# Altium schematic sheet Amp1.SchDoc
size A
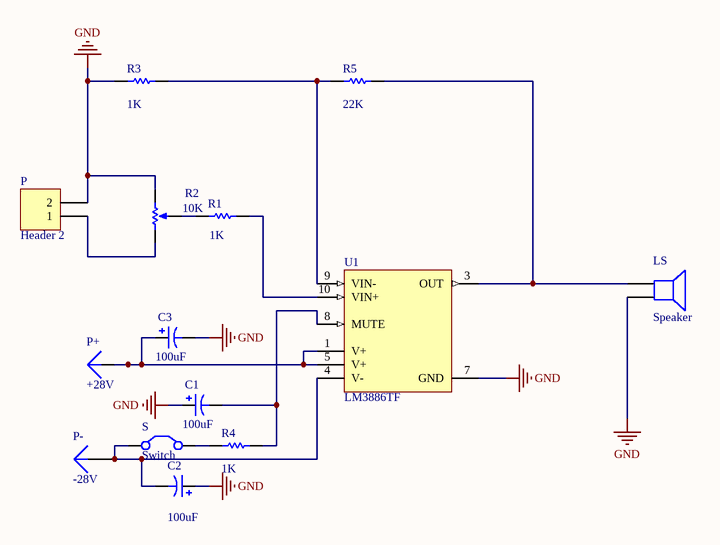
[diagram p0: Amp1.SchDoc]

## Parts
C1  value 100uF  [RB7.6-15]
C2  value 100uF  [RB7.6-15]
C3  value 100uF  [RB7.6-15]
LS  Speaker  [PIN2]
P  Header 2  [HDR1X2]
P+  +28V  [PIN1]
P-  -28V  [PIN1]
R1  value 1K  [AXIAL-0.3]
R2  value 10K  [VR5]
R3  value 1K  [AXIAL-0.3]
R4  value 1K  [AXIAL-0.3]
R5  value 22K  [AXIAL-0.3]
S  Switch  [RAD-0.2]
U1  LM3886TF  [TF11B]

## Nets
GND: C1.1 C2.1 C3.2 LS.2 P.2 R2.2(BOT) R3.1 U1.7(GND)
NetC1_2: C1.2 R4.2 U1.8(MUTE)
NetC2_2: C2.2 P-.1 S.1(C1) U1.4(V-)
NetC3_1: C3.1 P+.1 U1.1(V+) U1.5(V+)
NetLS_1: LS.1 R5.2 U1.3(OUT)
NetP_1: P.1 R2.1(TOP)
NetR1_1: R1.1 R2.3(TAP)
NetR1_2: R1.2 U1.10(VIN+)
NetR3_2: R3.2 R5.1 U1.9(VIN-)
NetR4_1: R4.1 S.2(C2)

## Library data of the parts
C1-C3 = Cap Pol1: Polarized Capacitor (Radial); Published: 8-Jun-2000; LatestRevisionDate: 17-Jul-2002; LatestRevisionNote: Re-released for DXP Platform.; PackageReference: RB7.6-15; Publisher: Altium Limited; PackageDescription: Polarized Capacitor (Radial); 2 Leads
LS = Speaker: Loudspeaker; Published: 24-Mar-1999; LatestRevisionDate: 17-Jul-2002; LatestRevisionNote: Re-released for DXP Platform.; PackageReference: PIN2; Publisher: Altium Limited
P = Header 2: Header, 2-Pin; LatestRevisionDate: 17-Jul-2002; LatestRevisionNote: Re-released for DXP Platform.; Publisher: Altium Limited
P+ P- = Plug: LatestRevisionDate: 17-Jul-2002; LatestRevisionNote: Re-released for DXP Platform.; Publisher: Altium Limited
R1 R3-R5 = Res1: Resistor; Published: 8-Jun-2000; LatestRevisionDate: 17-Jul-2002; LatestRevisionNote: Re-released for DXP Platform.; PackageReference: AXIAL-0.3; Publisher: Altium Limited; PackageDescription: Axial Device, Thru-Hole; 2 Leads; 0.3 in Pin Spacing
R2 = RPot: Potentiometer; Sim Note: Enter the Resistance value and the set point into parameter fields.; Set Position: 0.5; Published: 8-Jun-2000; LatestRevisionDate: 17-Jul-2002; LatestRevisionNote: Re-released for DXP Platform.; PackageReference: VR5; Publisher: Altium Limited; PackageDescription: Variable Resistor, Thru-Hole; 3 Leads
S = Jumper: Jumper Wire; Published: 24-Mar-1999; LatestRevisionDate: 17-Jul-2002; LatestRevisionNote: Re-released for DXP Platform.; PackageReference: RAD-0.2; Publisher: Altium Limited; PackageDescription: Radial Cap, Thru-Hole; 2 Leads; 0.2 in Pin Spacing
U1 = LM3886TF: High-Performance 68W Audio Power Amplifier with Mute, 11-pin Isolated TO220; Manufacturer: National Semiconductor; PackageTopMarking: NSUZXYTTE#*LM3886TF; PowerWise: N; CompType: Audio IC; Published: 4-Dec-2008; DatasheetVersion: Oct-2003; PackageVersion: revD, Apr-2003; PackageReference: TF11B; Publisher: Altium Limited; PackageDescription: TO-220, Molded, .788 x .771 x .177in Body, 11 Bent Staggered Leads, .067in Pitch; Supplier 1: Farnell; Supplier Part Number 1: 9489681; Supplier 2: Farnell; Supplier Part Number 2: 1523846; PartNumber: LM3886TF; RoHS: N; PinCount: 11; ComponentLink1Description: LM3886 Datasheet; ComponentLink1URL: http://www.national.com/ds/LM/LM3886.pdf; ComponentLink2Description: LM3886 Web Page; ComponentLink2URL: http://www.national.com/pf/LM/LM3886.html; ComponentLink3Description: TF11B Package Page; ComponentLink3URL: http://www.national.com/packaging/folders/tf11b.html